# EAGLE design xns-ip67-ESP12-Temp (EAGLE 8.1.0)
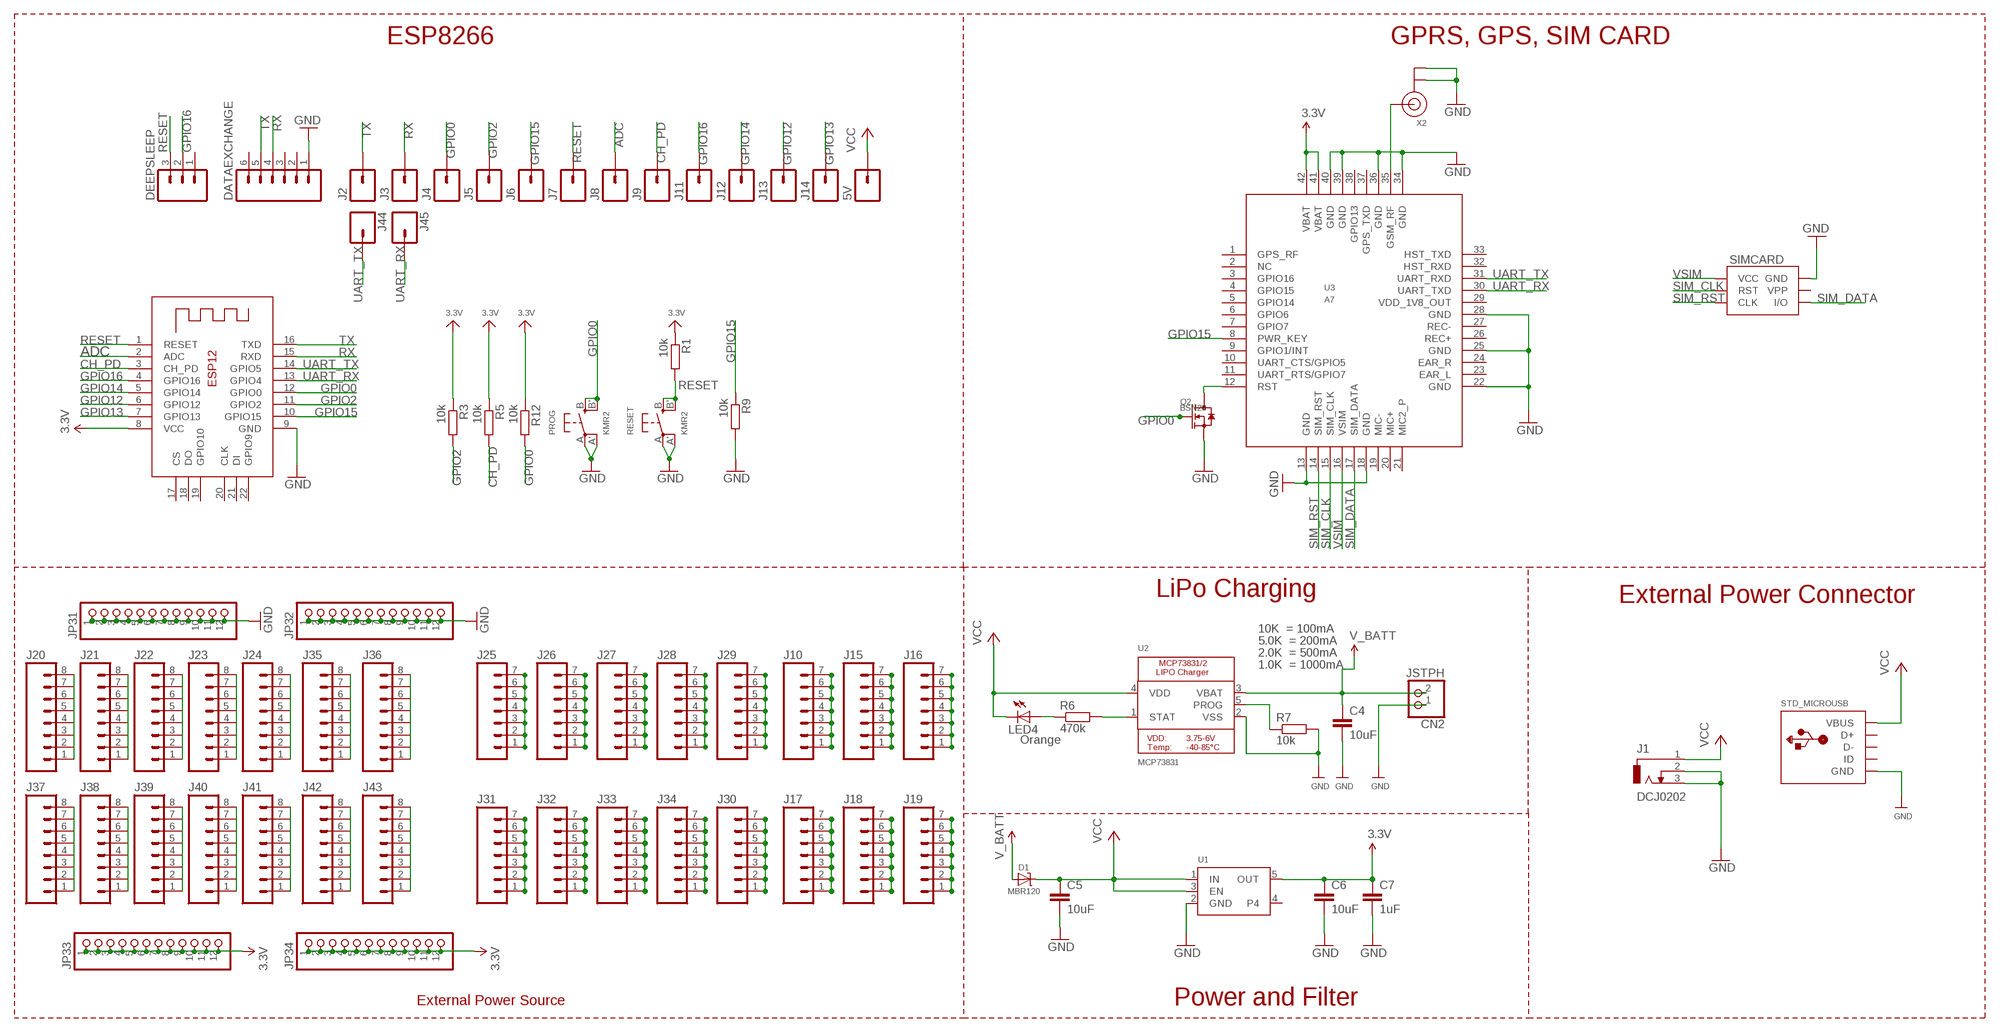
[diagram p0: schematic, sheet 1]

## Parts
5V  M01NOSILK-KIT  [1X01NS-KIT]
C4  10uF  C2.5/2  [C2.5-2]
C5  10uF  C2.5/2  [C2.5-2]
C6  10uF  C2.5/2  [C2.5-2]
C7  1uF  C2.5/2  [C2.5-2]
CN2  JSTPH  JST_2PIN  [JSTPH2]
D1  MBR120  DIODE-SCHOTTKYSOD-123  [SOD-123]
DATAEXCHANGE  M06FEMALE_LOCK  [1X06_FEMALE_LOCK.010]
DEEPSLEEP  M031X03_NO_SILK  [1X03_NO_SILK]
J1  DCJ0202  [DCJ0202]
J2  M01NOSILK-KIT  [1X01NS-KIT]
J3  M01NOSILK-KIT  [1X01NS-KIT]
J4  M01NOSILK-KIT  [1X01NS-KIT]
J5  M01NOSILK-KIT  [1X01NS-KIT]
J6  M01NOSILK-KIT  [1X01NS-KIT]
J7  M01NOSILK-KIT  [1X01NS-KIT]
J8  M01NOSILK-KIT  [1X01NS-KIT]
J9  M01NOSILK-KIT  [1X01NS-KIT]
J10  M07NO_SILK  [1X07_NO_SILK]
J11  M01NOSILK-KIT  [1X01NS-KIT]
J12  M01NOSILK-KIT  [1X01NS-KIT]
J13  M01NOSILK-KIT  [1X01NS-KIT]
J14  M01NOSILK-KIT  [1X01NS-KIT]
J15  M07NO_SILK  [1X07_NO_SILK]
J16  M07NO_SILK  [1X07_NO_SILK]
J17  M07NO_SILK  [1X07_NO_SILK]
J18  M07NO_SILK  [1X07_NO_SILK]
J19  M07NO_SILK  [1X07_NO_SILK]
J20  M08NO_SILK_FEMALE_PTH  [1X08_NO_SILK]
J21  M08NO_SILK_FEMALE_PTH  [1X08_NO_SILK]
J22  M08NO_SILK_FEMALE_PTH  [1X08_NO_SILK]
J23  M08NO_SILK_FEMALE_PTH  [1X08_NO_SILK]
J24  M08NO_SILK_FEMALE_PTH  [1X08_NO_SILK]
J25  M07NO_SILK  [1X07_NO_SILK]
J26  M07NO_SILK  [1X07_NO_SILK]
J27  M07NO_SILK  [1X07_NO_SILK]
J28  M07NO_SILK  [1X07_NO_SILK]
J29  M07NO_SILK  [1X07_NO_SILK]
J30  M07NO_SILK  [1X07_NO_SILK]
J31  M07NO_SILK  [1X07_NO_SILK]
J32  M07NO_SILK  [1X07_NO_SILK]
J33  M07NO_SILK  [1X07_NO_SILK]
J34  M07NO_SILK  [1X07_NO_SILK]
J35  M08NO_SILK_FEMALE_PTH  [1X08_NO_SILK]
J36  M08NO_SILK_FEMALE_PTH  [1X08_NO_SILK]
J37  M08NO_SILK_FEMALE_PTH  [1X08_NO_SILK]
J38  M08NO_SILK_FEMALE_PTH  [1X08_NO_SILK]
J39  M08NO_SILK_FEMALE_PTH  [1X08_NO_SILK]
J40  M08NO_SILK_FEMALE_PTH  [1X08_NO_SILK]
J41  M08NO_SILK_FEMALE_PTH  [1X08_NO_SILK]
J42  M08NO_SILK_FEMALE_PTH  [1X08_NO_SILK]
J43  M08NO_SILK_FEMALE_PTH  [1X08_NO_SILK]
J44  M01NOSILK-KIT  [1X01NS-KIT]
J45  M01NOSILK-KIT  [1X01NS-KIT]
JP31  HEADER-1X12  [1X12_ROUND]
JP32  HEADER-1X12  [1X12_ROUND]
JP33  HEADER-1X12  [1X12_ROUND]
JP34  HEADER-1X12  [1X12_ROUND]
LED4  Orange  LED5MM  [LED5MM]
PROG  KMR2  SWITCH_TACT_SMT4.6X2.8  [BTN_KMR2_4.6X2.8]
Q2  BSN20  MOSFET-N'SOT23'  [SOT23@1]
R1  10k  R0204/7  [0204/7]
R3  10k  R0204/7  [0204/7]
R5  10k  R0204/7  [0204/7]
R6  470k  R0204/7  [0204/7]
R7  10k  R0204/7  [0204/7]
R9  10k  R0204/7  [0204/7]
R12  10k  R0204/7  [0204/7]
RESET  KMR2  SWITCH_TACT_SMT4.6X2.8  [BTN_KMR2_4.6X2.8]
SIMCARD  SIMHOLDERSIM  [SIMHOLDER]
STD_MICROUSB  USB_MICRO_20329_V2  [4UCONN_20329_V2]
U1  VREG_SOT23-5  [SOT23-5]
U2  MCP73831  MCP73831/2  [SOT23-5@1]
U3  A7  [A7]
X1  ESP-12E  [ESP-12E]
X2  ANTENNA_U.FL  [U.FL]

## Nets
3.3V: C6.1 C7.1 JP33.1 JP33.2 JP33.3 JP33.4 JP33.5 JP33.6 JP33.7 JP33.8 JP33.9 JP33.10 JP33.11 JP33.12 JP34.1 JP34.2 JP34.3 JP34.4 JP34.5 JP34.6 JP34.7 JP34.8 JP34.9 JP34.10 JP34.11 JP34.12 R1.1 R3.1 R5.1 R12.1 U1.5(OUT) U3.41(VBAT) U3.42(VBAT) X1.8(VCC)
ADC: J8.1 X1.2(ADC)
CH_PD: J9.1 R5.2 X1.3(CH_PD)
GND: C4.2 C5.2 C6.2 C7.2 CN2.1 DATAEXCHANGE.1 J1.2 J1.3 JP31.1 JP31.2 JP31.3 JP31.4 JP31.5 JP31.6 JP31.7 JP31.8 JP31.9 JP31.10 JP31.11 JP31.12 JP32.1 JP32.2 JP32.3 JP32.4 JP32.5 JP32.6 JP32.7 JP32.8 JP32.9 JP32.10 JP32.11 JP32.12 PROG.A'(P1) PROG.A(P) Q2.2(S) R7.2 R9.2 RESET.A'(P1) RESET.A(P) SIMCARD.C5(GND) STD_MICROUSB.BASE@1(GND) STD_MICROUSB.BASE@2(GND) STD_MICROUSB.GND STD_MICROUSB.SPRT@1(GND) STD_MICROUSB.SPRT@2(GND) STD_MICROUSB.SPRT@3(GND) STD_MICROUSB.SPRT@4(GND) U1.2(GND) U2.2(VSS) U3.13(GND) U3.18(GND) U3.22(GND) U3.25(GND) U3.28(GND) U3.34(GND) U3.36(GND) U3.39(GND) U3.40(GND) X1.9(GND) X2.1(GND) X2.2(GND)
GPIO0: J4.1 PROG.B'(S1) PROG.B(S) Q2.1(G) R12.2 X1.12(GPIO0)
GPIO2: J5.1 R3.2 X1.11(GPIO2)
GPIO12: J13.1 X1.6(GPIO12)
GPIO13: J14.1 X1.7(GPIO13)
GPIO14: J12.1 X1.5(GPIO14)
GPIO15: J6.1 R9.1 U3.8(PWR_KEY) X1.10(GPIO15)
GPIO16: DEEPSLEEP.2 J11.1 X1.4(GPIO16)
N$1: J20.1 J20.2 J20.3 J20.4 J20.5 J20.6 J20.7 J20.8
N$2: J21.1 J21.2 J21.3 J21.4 J21.5 J21.6 J21.7 J21.8
N$3: U3.35(GSM_RF) X2.3(SIGNAL)
N$4: J22.1 J22.2 J22.3 J22.4 J22.5 J22.6 J22.7 J22.8
N$5: J23.1 J23.2 J23.3 J23.4 J23.5 J23.6 J23.7 J23.8
N$6: J24.1 J24.2 J24.3 J24.4 J24.5 J24.6 J24.7 J24.8
N$7: J35.1 J35.2 J35.3 J35.4 J35.5 J35.6 J35.7 J35.8
N$8: J37.1 J37.2 J37.3 J37.4 J37.5 J37.6 J37.7 J37.8
N$9: J38.1 J38.2 J38.3 J38.4 J38.5 J38.6 J38.7 J38.8
N$10: J39.1 J39.2 J39.3 J39.4 J39.5 J39.6 J39.7 J39.8
N$11: J40.1 J40.2 J40.3 J40.4 J40.5 J40.6 J40.7 J40.8
N$12: J10.1 J10.2 J10.3 J10.4 J10.5 J10.6 J10.7
N$13: J41.1 J41.2 J41.3 J41.4 J41.5 J41.6 J41.7 J41.8
N$14: J15.1 J15.2 J15.3 J15.4 J15.5 J15.6 J15.7
N$15: J16.1 J16.2 J16.3 J16.4 J16.5 J16.6 J16.7
N$16: J17.1 J17.2 J17.3 J17.4 J17.5 J17.6 J17.7
N$17: J18.1 J18.2 J18.3 J18.4 J18.5 J18.6 J18.7
N$18: J19.1 J19.2 J19.3 J19.4 J19.5 J19.6 J19.7
N$19: J42.1 J42.2 J42.3 J42.4 J42.5 J42.6 J42.7 J42.8
N$20: J36.1 J36.2 J36.3 J36.4 J36.5 J36.6 J36.7 J36.8
N$21: J43.1 J43.2 J43.3 J43.4 J43.5 J43.6 J43.7 J43.8
N$24: R7.1 U2.5(PROG)
N$52: J31.1 J31.2 J31.3 J31.4 J31.5 J31.6 J31.7
N$54: J32.1 J32.2 J32.3 J32.4 J32.5 J32.6 J32.7
N$55: R6.2 U2.1(STAT)
N$56: J33.1 J33.2 J33.3 J33.4 J33.5 J33.6 J33.7
N$58: J34.1 J34.2 J34.3 J34.4 J34.5 J34.6 J34.7
N$59: LED4.A R6.1
N$71: J25.1 J25.2 J25.3 J25.4 J25.5 J25.6 J25.7
N$72: J26.1 J26.2 J26.3 J26.4 J26.5 J26.6 J26.7
N$73: J27.1 J27.2 J27.3 J27.4 J27.5 J27.6 J27.7
N$74: J28.1 J28.2 J28.3 J28.4 J28.5 J28.6 J28.7
N$75: J29.1 J29.2 J29.3 J29.4 J29.5 J29.6 J29.7
N$76: J30.1 J30.2 J30.3 J30.4 J30.5 J30.6 J30.7
RESET: DEEPSLEEP.3 J7.1 R1.2 RESET.B'(S1) RESET.B(S) X1.1(RESET)
RESET_KEY: Q2.3(D) U3.12(RST)
RX: DATAEXCHANGE.4 J3.1 X1.15(RXD)
SIM_CLK: SIMCARD.C2(RST) U3.15(SIM_CLK)
SIM_DATA: SIMCARD.C7(I/O) U3.17(SIM_DATA)
SIM_RST: SIMCARD.C3(CLK) U3.14(SIM_RST)
TX: DATAEXCHANGE.5 J2.1 X1.16(TXD)
UART_RX: J45.1 U3.30(UART_TXD) X1.13(GPIO4)
UART_TX: J44.1 U3.31(UART_RXD) X1.14(GPIO5)
V_BATT: C4.1 CN2.2 D1.A U2.3(VBAT)
VCC: 5V.1 C5.1 D1.C J1.1 LED4.K(C) STD_MICROUSB.VBUS U1.1(IN) U1.3(EN) U2.4(VDD)
VSIM: SIMCARD.C1(VCC) U3.16(VSIM)
Unconnected: DATAEXCHANGE.2 DATAEXCHANGE.3 DATAEXCHANGE.6 DEEPSLEEP.1 SIMCARD.C6(VPP) STD_MICROUSB.D+ STD_MICROUSB.D- STD_MICROUSB.ID U1.4 U3.1(GPS_RF) U3.2(NC) U3.3(GPIO16) U3.4(GPIO15) U3.5(GPIO14) U3.6(GPIO6) U3.7(GPIO7) U3.9(GPIO1/INT) U3.10(UART_CTS/GPIO5) U3.11(UART_RTS/GPIO7) U3.19(MIC-) U3.20(MIC+) U3.21(MIC2_P) U3.23(EAR_L) U3.24(EAR_R) U3.26(REC+) U3.27(REC-) U3.29(VDD_1V8_OUT) U3.32(HST_RXD) U3.33(HST_TXD) U3.37(GPS_TXD) U3.38(GPIO13) X1.17(CS) X1.18(DO) X1.19(GPIO10) X1.20(CLK) X1.21(DI) X1.22(GPIO9)

## Notes on the sheet
- ESP8266 | GPRS, GPS, SIM CARD
- LiPo Charging | External Power Connector
- 10K  = 100mA
- 5.0K  = 200mA
- 2.0K  = 500mA
- 1.0K  = 1000mA
- External Power Source | Power and Filter

## Library data of the parts
5V J2-J9 J11-J14 J44 J45 = SparkFun-Connectors:M01: Header 1 Standard 1-pin 0.1" header. Use with straight break away headers (SKU : PRT-00116), right angle break away headers (PRT-00553), swiss pins (PRT-00743), machine pins (PRT-00117), and female headers (PRT-00115). SMTSO-256-ET is a "flush mount" nut for a 4-40 screw. The older package used to be too tight, and did not allow it to sit properly thru the drill hit. The latest (0.165DIA) fits nice and snug.
C4-C7 = capacitor-wima:C: CAPACITOR naming: grid - package width
CN2 = microbuilder:JST_2PIN: JST 2-Pin Right-Angle Connector PH-Series - 4UConnector: 17311 SH-Series - 4UConnector: 07278
D1 = microbuilder:DIODE-SCHOTTKY
DATAEXCHANGE = SparkFun-Connectors:M06: Header 6 Standard 6-pin 0.1" header. Use with straight break away headers (SKU : PRT-00116), right angle break away headers (PRT-00553), swiss pins (PRT-00743), machine pins (PRT-00117), and female headers (PRT-00115). Molex polarized connector foot print use with SKU : PRT-08094 with associated crimp pins and housings. NOTES ON THE VARIANTS LOCK and LOCK_LONGPADS... This footprint was designed to help hold the alignment of a through-hole component (i.e. 6-pin header) while soldering it into place. You may notice that each hole has been shifted either up or down by 0.005 of an inch from it's more standard position (which is a perfectly straight line). This slight alteration caused the pins (the squares in the middle) to touch the edges of the holes. Because they are alternating, it causes a "brace" to hold the component in place. 0.005 has proven to be the perfect amount of "off-center" position when using our standard breakaway headers. Although looks a little odd when you look at the bare footprint, once you have a header in there, the alteration is very hard to notice. Also,if you push a header all the way into place, it is covered up entirely on the bottom side. This idea of altering the position of holes to aid alignment will be further integrated into the Sparkfun Library for other footprints. It can help hold any component with 3 or more connection pins.
DEEPSLEEP = SparkFun-Connectors:M03: Header 3 Standard 3-pin 0.1" header. Use with straight break away headers (SKU : PRT-00116), right angle break away headers (PRT-00553), swiss pins (PRT-00743), machine pins (PRT-00117), and female headers (PRT-00115). Molex polarized connector foot print use with SKU : PRT-08232 with associated crimp pins and housings.
J1 = con-jack:DCJ0202: DC POWER JACK Source: DCJ0202.pdf; OC_FARNELL: unknown; OC_NEWARK: unknown
J10 J15-J19 J25-J34 = SparkFun-Connectors:M07: Header 7 Standard 7-pin 0.1" header. Use with straight break away headers (SKU : PRT-00116), right angle break away headers (PRT-00553), swiss pins (PRT-00743), machine pins (PRT-00117), and female headers (PRT-00115). NOTES ON THE VARIANTS LOCK and LOCK_LONGPADS... This footprint was designed to help hold the alignment of a through-hole component (i.e. 7-pin header) while soldering it into place. You may notice that each hole has been shifted either up or down by 0.005 of an inch from it's more standard position (which is usually a perfectly straight line). This slight alteration caused the pins (the squares in the middle) to touch the edges of the holes. Because they are alternating, it causes a "brace" to hold the header in place. 0.005 has proven to be the perfect amount of "off-center" position when using our standard breakaway headers. Although looks a little odd when you look at the bare footprint, once you have a header in there, the alteration is very hard to notice. Also, if you push a header all the way into place, it is covered up entirely on the bottom side. This idea of altering the position of holes to aid alignment will be further integrated into the Sparkfun Library for other footprints. It can help hold any component with 3 or more connection pins.
J20-J24 J35-J43 = SparkFun-Connectors:M08: Header 8 Standard 8-pin 0.1" header. Use with straight break away headers (SKU : PRT-00116), right angle break away headers (PRT-00553), swiss pins (PRT-00743), machine pins (PRT-00117), and female headers (PRT-00115).; PROD_ID: CONN-08438
JP31-JP34 = microbuilder:HEADER-1X12
LED4 = adafruit:LED: LED OSRAM: - CHIPLED LG R971, LG N971, LY N971, LG Q971, LY Q971, LO R971, LY R971 LH N974, LH R974 LS Q976, LO Q976, LY Q976 LO Q996 - Hyper CHIPLED LW Q18S LB Q993, LB Q99A, LB R99A - SideLED LS A670, LO A670, LY A670, LG A670, LP A670 LB A673, LV A673, LT A673, LW A673 LH A674 LY A675 LS A676, LA A676, LO A676, LY A676, LW A676 LS A679, LY A679, LG A679 - Hyper Micro SIDELED® LS Y876, LA Y876, LO Y876, LY Y876 LT Y87S - SmartLED LW L88C, LW L88S LB L89C, LB L89S, LG L890 LS L89K, LO L89K, LY L89K LS L896, LA L896, LO L896, LY L896 - TOPLED LS T670, LO T670, LY T670, LG T670, LP T670 LSG T670, LSP T670, LSY T670, LOP T670, LYG T670 LG T671, LOG T671, LSG T671 LB T673, LV T673, LT T673, LW T673 LH T674 LS T676, LA T676, LO T676, LY T676, LB T676, LH T676, LSB T676, LW T676 LB T67C, LV T67C, LT T67C, LS T67K, LO T67K, LY T67K, LW E67C LS E67B, LA E67B, LO E67B, LY E67B, LB E67C, LV E67C, LT E67C LW T67C LS T679, LY T679, LG T679 LS T770, LO T770, LY T770, LG T770, LP T770 LB T773, LV T773, LT T773, LW T773 LH T774 LS E675, LA E675, LY E675, LS T675 LS T776, LA T776, LO T776, LY T776, LB T776 LHGB T686 LT T68C, LB T68C - Hyper Mini TOPLED® LB M676 - Mini TOPLED Santana® LG M470 LS M47K, LO M47K, LY M47K Source: http://www.osram.convergy.de/
PROG RESET = microbuilder:SWITCH_TACT_SMT: SMT Tact Switches 6x6mm - Digikey: P12940SCT-ND KMR2 (4.6x2.8mm) - Digikey: 401-1426-1-ND EVQ-PQHB55 - Light Touch, 160GF (4.5x4.5mm) - Digikey: P8090SCT-ND KMT0 - KMT021 NGJ LHS (etc.) IP68/Waterproof - Digikey: CKN10289CT-ND
Q2 = Discrete:MOSFET-N: IRLL014: http://www.vishay.com/docs/91319/sihll014.pdf
R1 R3 R5-R7 R9 R12 = eagle-ltspice:R: RESISTOR, European symbol; SPICEMODEL: NONE; SPICEPREFIX: R
SIMCARD = SparkFun-Connectors:SIMHOLDER: SIM Socket Socket for SIM cellular cards. Schematic element and footprint production proven. Spark Fun Electronics SKU : PRT-00548; PROD_ID: CONN-08536
STD_MICROUSB = microbuilder:USB: USB Connectors USBMINIB - Surface Mount Female Mini-B USB Connector 4UConnector: 06564
U1 = microbuilder:VREG_SOT23-5: SOT23-5 Fixed Voltage Regulators Part Current Out V Out V In V Dropout θJA (°C/W) TJ (°C) Digikey Part No. ADP121 150mA 3.3V 3.4-5.5V 0.09V @ 150mA -- -- ADP121-AUJZ33R7CT-ND ADP121 150mA 3.0V 3.1-5.5V 0.09V @ 150mA -- -- ADP121-AUJZ30R7CT-ND ADP122 300mA 3.3V 3.4-5.5V 0.085V @ 300mA -- -- ADP122AUJZ-3.3-R7CT-ND ADP1712 300mA 3.3V 3.5-5.5V 0.17V @ 300mA -- -- ADP1712AUJZ-3.3-R7TR-ND AP7311 (Low Cost) 150mA 3.3V 3.5-6V 0.15V @ 150mA -- -- AP7311-33WG-7DICT-ND LD39015M18R 150mA 1.8V 1.9V-5.5V 0.08V @ 100mA -- -- 497-6977-1-ND LP2985A-33DBVR 150mA 3.3V 3.3-16V 0.28V @ 150mA 206 150 296-18479-1-ND MCP1824T-3302E/OT 300mA 3.3V 3.5V-6V 0.2V @ 300mA -- -- MCP1824T-3302E/OTCT-ND MIC5205-2.5YM5 TR 150mA 2.5V 2.7-16V 0.165V @ 150mA -- -- 576-1257-2-ND MIC5205-3.0YM5 TR 150mA 3.0V 3.2V-16V 0.165V @ 150mA -- -- 576-1258-2-ND MIC5205-3.3YM5 TR 150mA 3.3V 3.5V-16V 0.165V @ 150mA -- -- 576-1259-2-ND TPS780330220 150mA 3.3V+2.2V 3.6-5.5V 250mV Max -- -- 296-23332-1-ND TDA3663/N1,135 100mA 3.3V 3.5-45V 0.18V @ 50mA -- -- 568-5343-1-ND Max operating temp can be calculated using θJA, TJ (max junction temperature), and power in watts. Set the "Maximum Ambient Temperature" until it reaches TJ ("Max Junction Temperature"), which is the absolute limit for safe use of the regulator: Heat Sink Temperature Calculator <http://www.daycounter.com/Calculators/Heat-Sink-Temperature-Calculator.phtml> For example, With 12V source into a 3.3V LP2985 and a 30mA load, we are dissipating (12V-3.3V) * 0.03A = 0.261W. With a θJA of 206 °C/W, a TJ of 150°C, and 261mW we can safely use the chip without a heat sink up to 75°C (=147.1°C Junction Temperature).
U2 = microbuilder:MCP73831/2: MCP73831/2 LIPO Charger VDD: 3.75 - 6V Temp -40 - 85°C Programmable Charge Rate: 15-500mA NOTE: STAT is a tri-state logic output on the MCP73831 and an open-drain output on the MCP73832. SOT23-5 with 4.2V output and tri-state logic on STAT = MCP73831T-2ACI/OT
U3 = IC:A7
X1 = microbuilder:ESP-12E
X2 = adafruit:ANTENNA_U.FL: U.FL Antenna Connector

## Board
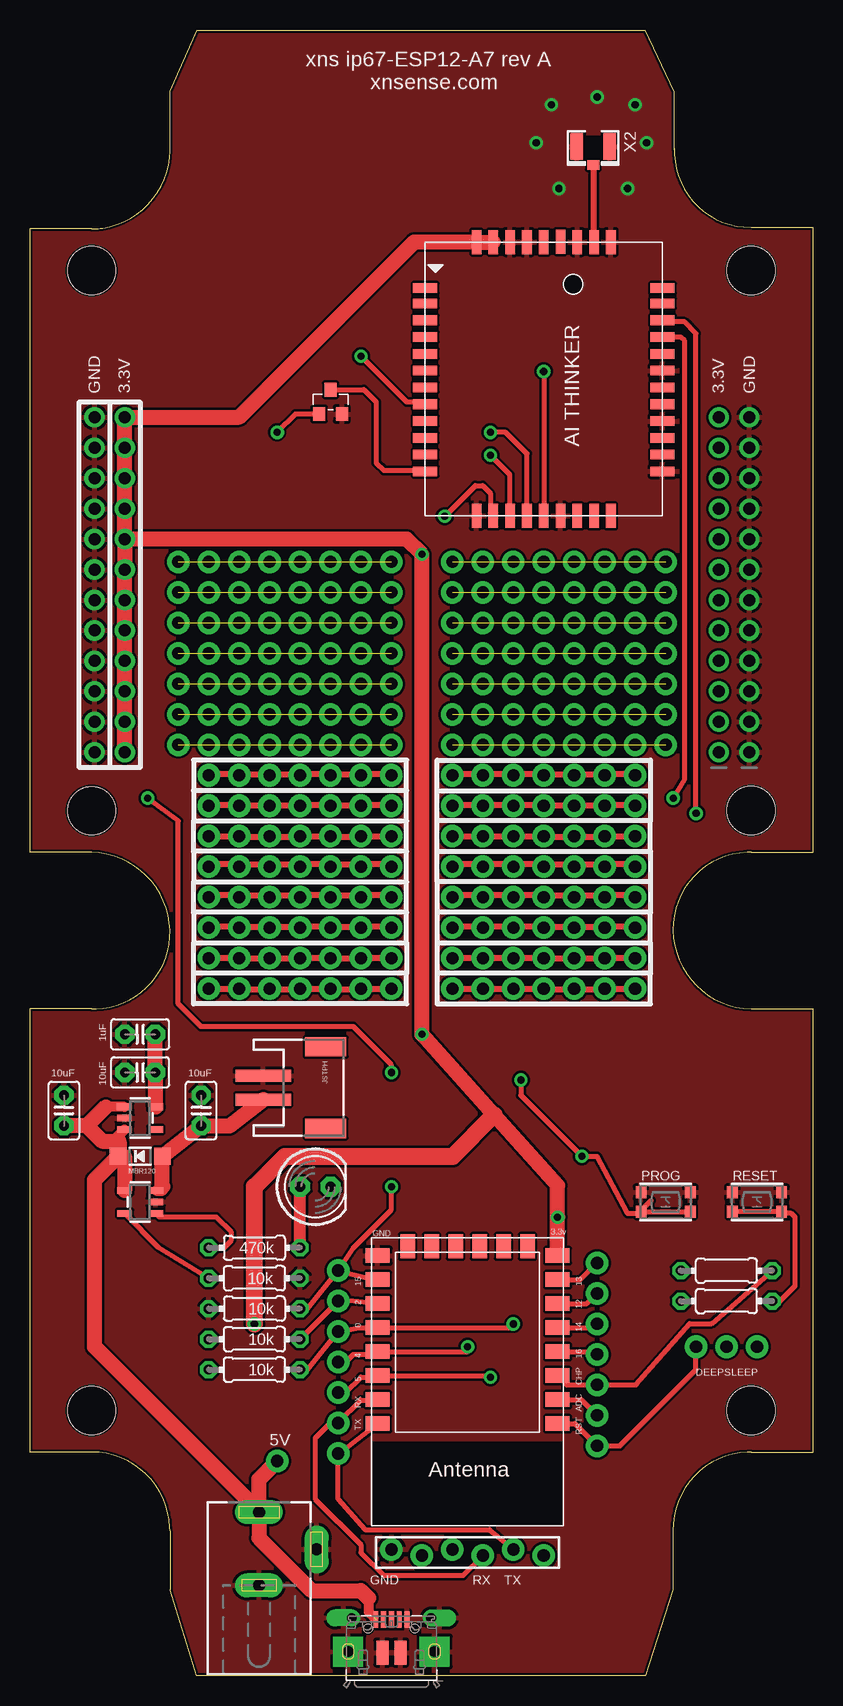
[diagram p1: board, top side]
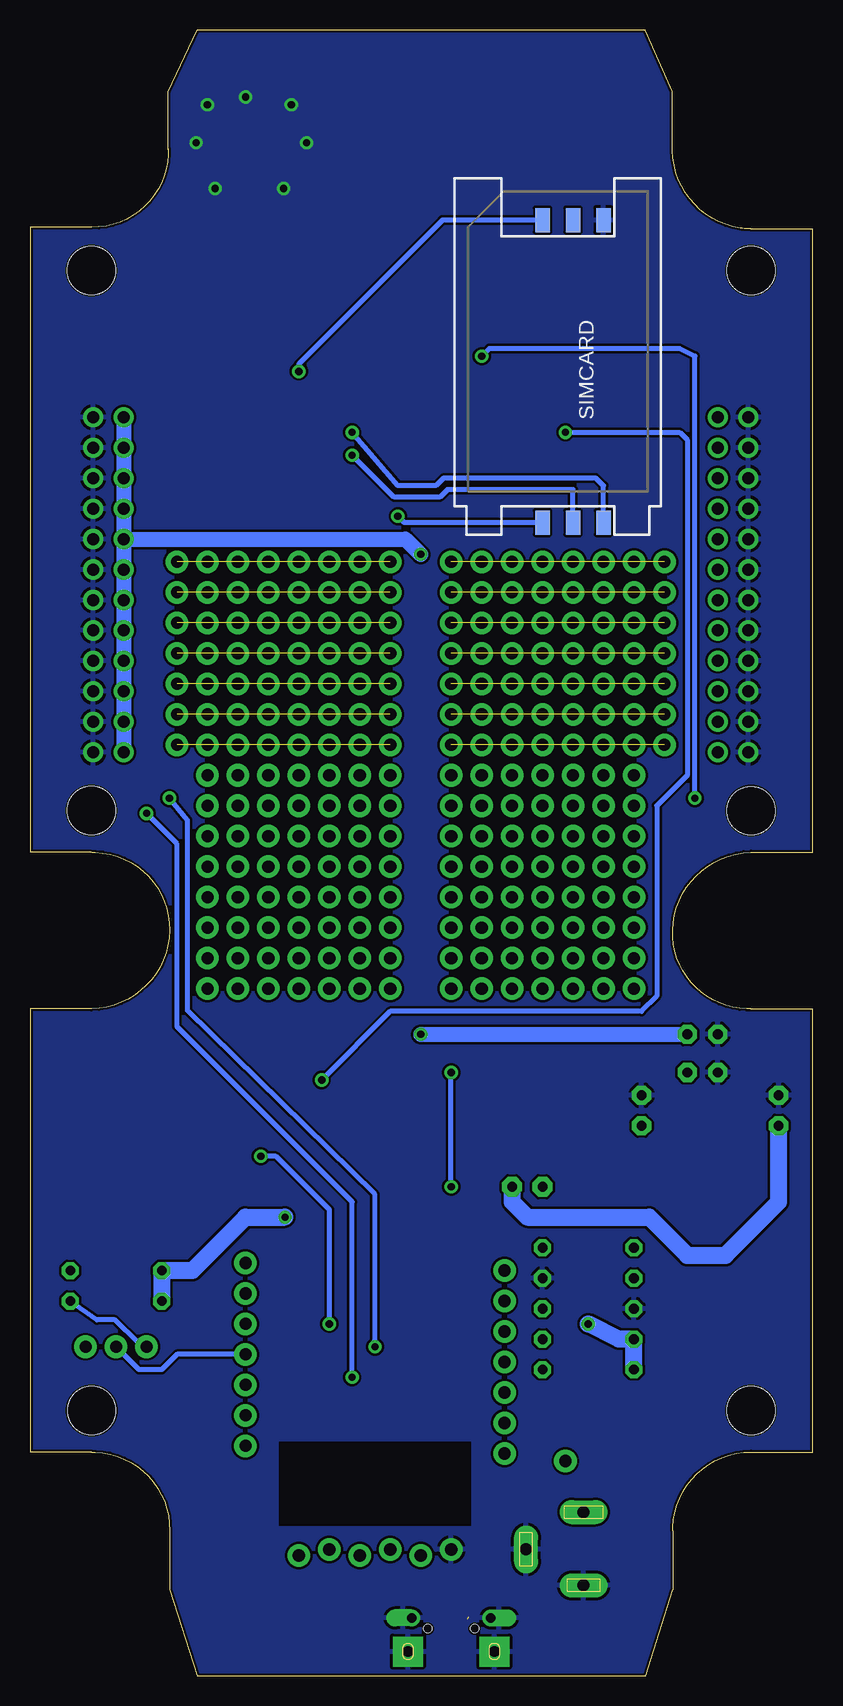
[diagram p2: board, bottom side, seen from below]

Size 65.26 x 137.16 mm. Coordinates in mm from the lower left corner, seen from the top.
Outline: 53.72,127.17 53.72,132.03 51.33,137.16 13.93,137.16 11.68,132.06 11.68,127.11 arc-80 6.05,120.65 arc-7 5.5,120.6 5.14,120.59 0.01,120.59 0.01,68.64 5.14,68.64 arc-87 11.67,62.12 arc-90 5.5,55.59 5.14,55.58 0,55.58 0,18.65 5.13,18.65 arc-88 11.66,12.37 11.67,12.11 11.67,7.17
Outline: 53.73,127.28 arc2 53.74,126.78 arc88 60.13,120.72 65.26,120.72 65.26,68.63 60.14,68.63
Outline: 60.13,68.63 59.81,68.62 arc89 53.62,62.12 arc88 60.13,55.59 65.26,55.59 65.26,18.64 60.13,18.64 59.82,18.63 arc89 53.62,12.09 53.62,7.17 51.33,0 13.9,0 11.67,7.17
Outline: 11.67,7.17 11.67,7.16
Copper layers (1*16): Top 0.035mm / dielectric 1.5mm / Bottom 0.035mm
Design rules "SparkFun *": minimum track width 8mil, minimum drill 20mil, track to track 8mil, track to pad 6mil, pad to pad 8mil, via to via 8mil, smd to smd 8mil, copper to edge 6mil, drill to drill 8mil, minimum pad ring 12mil, minimum via ring 10mil, stop-mask expansion 4mil, vias tented up to drill 20mil, thermal gap 10mil
Holes 4 mm at 5.14,117.11 60.13,117.12 5.14,72.1 60.13,72.11 5.14,22.12 60.12,22.12

### Footprints (pad centres in the part's own frame; a part is rotated, then mirrored left to right if it is on the bottom)
1X01NS-KIT = drill 1.016 pad 1.88: 1 0,0
C2.5-2 = drill 0.813 pad 1.6 octagon: 1 -1.27,0; 2 1.27,0
JSTPH2 = smd 1 x 4.6: 1 -1,-3.7; 2 1,-3.7 | smd 1.6 x 3.4: NC1 -3.4,1.5; NC2 3.4,1.5
SOD-123 = smd 1.4 x 1.4: A 1.85,0; C -1.85,0
1X06_FEMALE_LOCK.010 = drill 1.016 pad 1.88: 1 0,0.254; 2 2.54,-0.254; 3 5.08,0.254; 4 7.62,-0.254; 5 10.16,0.254; 6 12.7,-0.254
1X03_NO_SILK = drill 1.016 pad 1.88: 1 0,0; 2 2.54,0; 3 5.08,0
DCJ0202 = drill 1 pad 2 long: 1 0,3.1; 2 4.8,0; 3 0,-3
1X07_NO_SILK = drill 1.016 pad 1.88: 1 0,0; 2 2.54,0; 3 5.08,0; 4 7.62,0; 5 10.16,0; 6 12.7,0; 7 15.24,0
1X08_NO_SILK = drill 1.016 pad 1.88: 1 0,0; 2 2.54,0; 3 5.08,0; 4 7.62,0; 5 10.16,0; 6 12.7,0; 7 15.24,0; 8 17.78,0
1X12_ROUND = drill 1 pad 1.676: 1 -13.97,0; 2 -11.43,0; 3 -8.89,0; 4 -6.35,0; 5 -3.81,0; 6 -1.27,0; 7 1.27,0; 8 3.81,0; 9 6.35,0; 10 8.89,0; 11 11.43,0; 12 13.97,0
LED5MM = drill 0.813 pad 1.676 octagon: A -1.27,0; K 1.27,0
BTN_KMR2_4.6X2.8 = smd 0.9 x 1: A 2.05,0.8; A' -2.05,0.8; B 2.05,-0.8; B' -2.05,-0.8
SOT23@1 = smd 1.016 x 1.143: 1 -0.95,-1.016; 2 0.95,-1.016; 3 0,1.016
0204/7 = drill 0.813 octagon: 1 -3.81,0; 2 3.81,0
SIMHOLDER = smd 2 x 1.2: C1 -12.61,-3.81; C2 -12.61,-1.27; C3 -12.61,1.27; C5 12.61,-3.81; C6 12.61,-1.27; C7 12.61,1.27
4UCONN_20329_V2 = smd 1 x 2: BASE@1 -0.75,-2; BASE@2 0.75,-2 | smd 0.4 x 1.35: D+ 0,0.775; D- -0.65,0.775; GND 1.3,0.775; ID 0.65,0.775; VBUS -1.3,0.775 | drill 0.8 pad 1.2 offset: SPRT@1 -3.3,0.9; SPRT@2 3.3,0.9 | drill 0.9 pad 2.5 square: SPRT@3 -3.6,-1.9; SPRT@4 3.6,-1.9 | hole 0.7: -1.95,0; 1.95,0
SOT23-5 = smd 0.55 x 1.2: 1 -0.95,-1.3; 2 0,-1.3; 3 0.95,-1.3; 4 0.95,1.3; 5 -0.95,1.3
SOT23-5@1 = smd 0.55 x 1.2: 1 -0.95,-1.3; 2 0,-1.3; 3 0.95,-1.3; 4 0.95,1.3; 5 -0.95,1.3
A7 = smd 0.8 x 2: 1 7.57,9.9; 2 6.3,9.9; 3 4.9,9.9; 4 3.5,9.9; 5 2.1,9.9; 6 0.7,9.9; 7 -0.7,9.9; 8 -2.1,9.9; 9 -3.5,9.9; 10 -4.9,9.9; 11 -6.3,9.9; 12 -7.7,9.9; 22 -7.7,-9.9; 23 -6.3,-9.9; 24 -4.9,-9.9; 25 -3.5,-9.9; 26 -2.1,-9.9; 27 -0.7,-9.9; 28 0.7,-9.9; 29 2.1,-9.9; 30 3.5,-9.9; 31 4.9,-9.9; 32 6.3,-9.9; 33 7.57,-9.9 | smd 2 x 0.8: 13 -11.4,5.6; 14 -11.4,4.2; 15 -11.4,2.8; 16 -11.4,1.4; 17 -11.4,0; 18 -11.4,-1.4; 19 -11.4,-2.8; 20 -11.4,-4.2; 21 -11.4,-5.6; 34 11.4,-5.6; 35 11.4,-4.2; 36 11.4,-2.8; 37 11.46,-1.4; 38 11.4,0; 39 11.4,1.4; 40 11.4,2.8; 41 11.4,4.2; 42 11.4,5.6
ESP-12E = smd 2 x 1.2: 1 -7.5,5.77; 2 -7.5,3.77; 3 -7.5,1.77; 4 -7.5,-0.23; 5 -7.5,-2.23; 6 -7.5,-4.23; 7 -7.5,-6.23; 8 -7.5,-8.23; 9 7.5,-8.23; 10 7.5,-6.23; 11 7.5,-4.23; 12 7.5,-2.23; 13 7.5,-0.23; 14 7.5,1.77; 15 7.5,3.77; 16 7.5,5.77 | smd 1.2 x 2: 17 -5,-9; 18 -3,-9; 19 -1,-9; 20 1,-9; 21 3,-9; 22 5,-9
U.FL = smd 2.2 x 1.05: 1 0,1.375; 2 0,-1.375 | smd 0.8 x 1: 3 1.525,0

### Placement (x,y rotation side)
5V  20.62,17.9 0 top
C4  14.26,47.11 90 top
C5  2.83,47.11 90 top
C6  9.19,50.29 180 top
C7  9.19,53.46 180 top
CN2  23.16,49.02 270 top
D1  9.19,43.3 0 top
DATAEXCHANGE  30.14,10.28 0 top
DEEPSLEEP  60.62,27.43 180 top
J1  19.1,10.55 0 top
J2  25.7,18.54 0 top
J3  25.7,21.08 0 top
J4  25.7,28.7 0 top
J5  25.7,31.23 0 top
J6  25.7,33.77 0 top
J7  47.29,19.17 0 top
J8  47.29,21.71 0 top
J9  47.29,24.25 0 top
J10  14.9,62.35 0 top
J11  47.29,26.79 0 top
J12  47.29,29.33 0 top
J13  47.29,31.87 0 top
J14  47.29,34.41 0 top
J15  14.9,59.81 0 top
J16  14.9,57.27 0 top
J17  35.22,62.35 0 top
J18  35.22,59.81 0 top
J19  35.22,57.27 0 top
J20  12.36,85.21 0 top
J21  12.36,92.83 0 top
J22  12.36,90.29 0 top
J23  12.36,87.75 0 top
J24  12.36,82.67 0 top
J25  50.46,64.89 180 top
J26  50.46,67.43 180 top
J27  50.46,69.97 180 top
J28  50.46,72.51 180 top
J29  50.46,75.05 180 top
J30  30.14,64.89 180 top
J31  30.14,67.43 180 top
J32  30.14,69.97 180 top
J33  30.14,72.51 180 top
J34  30.14,75.05 180 top
J35  12.36,80.13 0 top
J36  35.22,92.83 0 top
J37  35.22,90.29 0 top
J38  35.22,87.75 0 top
J39  35.22,85.21 0 top
J40  35.22,82.67 0 top
J41  35.22,80.13 0 top
J42  35.22,77.59 0 top
J43  12.36,77.59 0 top
J44  25.7,23.62 0 top
J45  25.7,26.16 0 top
JP31  5.38,90.92 90 top
JP32  59.99,90.92 90 top
JP33  57.45,90.92 90 top
JP34  7.91,90.92 90 top
LED4  23.79,40.76 0 top
PROG  53,39.49 0 top
Q2  25.06,106.16 0 top
R1  58.08,31.23 0 top
R3  18.71,28.06 0 top
R5  58.08,33.77 0 top
R6  18.71,35.68 180 top
R7  18.71,33.14 0 top
R9  18.71,30.6 180 top
R12  18.71,25.52 0 top
RESET  60.62,39.49 0 top
SIMCARD  21.25,108.7 90 bottom
STD_MICROUSB  30.14,3.93 0 top
U1  9.19,46.48 270 top
U2  9.19,39.49 90 top
U3  42.84,108.07 90 top
X1  36.49,26.79 180 top
X2  46.97,127.44 270 top

### Tracks (layer width: path | path; a pad name or v marks a point on that pad's centre or on a via)
3.3V  (via drill 0.6)
  Top 1.27: U1.5 10.48,50.26 C6.1 C7.1 | JP34.1 JP34.2 JP34.3 JP34.4 JP34.5 JP34.6 JP34.7 JP34.8 | JP34.8 JP34.9 JP34.10 JP34.11 JP34.12 17.44,104.89 32.05,119.5 37.21,119.5 U3.42 | U3.42 U3.41 | U3.42 37.24,119.38 | X1.8 v43.99,38.22 43.99,40.88 38.71,46.76 v32.68,53.46 v32.68,93.46 31.41,94.73 JP34.8
  Top 1.422: v18.71,29.33 18.71,40.76 21.25,43.3 35.25,43.3 38.71,46.76
  Bottom 1.27: JP33.12 JP33.11 JP33.10 JP33.9 JP33.8 | JP33.8 JP33.7 JP33.6 JP33.5 JP33.4 JP33.3 JP33.2 JP33.1 | v32.68,53.46 C7.1 | JP33.8 33.95,94.73 v32.68,93.46
  Bottom 1.422: v43.99,38.22 47.29,38.22 51.73,33.77 R5.1 R1.1 | R12.1 R3.1 16.17,28.06 v18.71,29.33
ADC
  Top 0.406: X1.2 45.98,23.02 J8.1
CH_PD
  Top 0.406: X1.3 44.76,24.25 J9.1 50.53,24.25 55,29.36 56.84,29.36 R5.2
GND  (via drill 0.6)
  Top 0.5: 7.92,46.48 U1.2 7.92,46.48
  Bottom 0.5: 17.38,121.17 SIMCARD.C5 | 5.64,105.19 JP31.12
  other vias: 43.48,130.93 47.29,131.56 42.2,127.75 44.11,123.94 49.83,123.94 51.41,127.75 50.46,130.93
  pour Top: -0.34,137.28 65.7,137.28 65.7,-1.15 0.29,-1.15
  pour Bottom: 65.7,137.28 -0.34,137.28 0.29,-1.15 65.7,-1.15
GPIO0  (via drill 0.6)
  Top 0.406: 29.3,29.33 X1.12 | R12.2 23.16,25.52 J4.1 27.4,29.01 X1.12 | PROG.B' PROG.B | PROG.B' 50.95,38.77 51.81,39.62 | X1.12 39.99,29.02 v40.3,29.33 | PROG.B' 50.8,38.54 49.83,38.54 47.29,43.3 v46.02,43.3 40.94,48.38 v40.94,49.65 | Q2.1 22.14,105.15 v20.62,103.62
  Bottom 0.406: v40.3,29.33 40.3,38.86 44.75,43.3 v46.02,43.3 | v40.94,49.65 35.22,55.37 14.26,55.37 12.99,56.63 12.99,72.51 10.46,75.05 10.46,102.99 11.09,103.62 v20.62,103.62
GPIO2
  Top 0.406: X1.11 25.8,31.34 J5.1 R3.2
GPIO12
  Top 0.406: X1.6 46.44,31.02 J13.1
GPIO13
  Top 0.406: X1.7 45.9,33.02 J14.1
GPIO14
  Top 0.406: X1.5 46.98,29.02 J12.1
GPIO15  (via drill 0.6)
  Top 0.406: R9.1 23.16,30.6 J6.1 | J6.1 28.23,33.14 X1.10 | J6.1 26.96,35.68 30.14,38.86 v30.14,40.76 | v30.14,50.29 30.14,50.92 26.96,54.09 14.26,54.09 12.36,56 12.36,71.24 v9.82,73.14 | v27.6,109.97 31.41,106.16 32.75,106.16 U3.8
  Bottom 0.406: v30.14,40.76 v30.14,50.29 | v9.82,73.14 9.82,109.97 11.09,110.61 26.96,110.61 v27.6,109.97
GPIO16
  Top 0.406: X1.4 47.05,27.02 J11.1
  Bottom 0.406: J11.1 53,26.79 54.27,25.52 56.18,25.52 DEEPSLEEP.2
N$1  (7 unrouted)
N$2  (7 unrouted)
N$3
  Top 0.406: 47.04,125.84 X2.3
  Top 0.508: U3.35 47.04,125.84
N$4  (7 unrouted)
N$5  (7 unrouted)
N$6  (7 unrouted)
N$7  (7 unrouted)
N$8  (7 unrouted)
N$9  (7 unrouted)
N$10  (7 unrouted)
N$11  (7 unrouted)
N$12
  Top 0.5: J10.7 30.1,62.42 27.82,62.42 J10.6 27.49,62.42 25.21,62.42 J10.5 24.88,62.42 22.6,62.42 J10.4 22.27,62.42 19.99,62.42 J10.3 19.66,62.42 17.7,62.42 J10.2 17.38,62.42 15.1,62.42 J10.1
N$13  (7 unrouted)
N$14
  Top 0.5: J15.7 30.1,59.82 27.82,59.82 J15.6 27.49,59.82 25.21,59.82 J15.5 24.88,59.82 22.6,59.82 J15.4 22.27,59.82 J15.3 19.66,59.82 17.7,59.82 J15.2 17.38,59.82 15.1,59.82 J15.1
N$15
  Top 0.5: J16.7 30.1,57.2 27.82,57.2 J16.6 27.49,57.2 25.21,57.2 J16.5 24.88,57.2 22.6,57.2 J16.4 22.27,57.2 19.99,57.2 J16.3 19.66,57.2 17.7,57.2 J16.2 17.38,57.2 15.1,57.2 J16.1
N$16
  Top 0.5: J17.7 50.33,62.42 48.04,62.42 J17.6 47.72,62.42 45.43,62.42 J17.5 45.11,62.42 43.15,62.42 J17.4 42.82,62.42 40.54,62.42 J17.3 40.21,62.42 37.93,62.42 J17.2 37.6,62.42 35.32,62.42 J17.1
N$17
  Top 0.5: J18.7 50.33,59.82 48.04,59.82 J18.6 47.72,59.82 45.43,59.82 J18.5 45.11,59.82 43.15,59.82 J18.4 42.82,59.82 40.54,59.82 J18.3 40.21,59.82 37.93,59.82 J18.2 37.6,59.82 35.32,59.82 J18.1
N$18
  Top 0.5: J19.7 50.33,57.2 48.04,57.2 J19.6 47.72,57.2 45.43,57.2 J19.5 45.11,57.2 43.15,57.2 J19.4 42.82,57.2 40.54,57.2 J19.3 40.21,57.2 37.93,57.2 J19.2 37.6,57.2 35.32,57.2 J19.1
N$19  (7 unrouted)
N$20  (7 unrouted)
N$21  (7 unrouted)
N$24
  Top 0.406: R7.1 10.74,35.68 U2.5
N$52
  Top 0.5: J31.1 30.1,67.64 27.82,67.64 J31.2 27.49,67.64 25.21,67.64 J31.3 24.88,67.64 22.6,67.64 J31.4 22.27,67.64 19.99,67.64 J31.5 19.66,67.64 17.7,67.64 J31.6 17.38,67.64 15.1,67.64 J31.7
N$54
  Top 0.5: J32.1 30.1,69.93 27.82,69.93 J32.2 27.49,69.93 25.21,69.93 J32.3 24.88,69.93 22.6,69.93 J32.4 22.27,69.93 19.99,69.93 J32.5 19.66,69.93 17.7,69.93 J32.6 17.38,69.93 15.1,69.93 J32.7
N$55
  Top 0.406: R6.2 16.17,35.68 16.8,36.32 16.8,36.95 15.53,38.22 10.8,38.22 U2.1
N$56
  Top 0.5: J33.1 30.1,72.54 27.82,72.54 J33.2 27.49,72.54 25.21,72.54 J33.3 24.88,72.54 22.6,72.54 J33.4 22.27,72.54 19.99,72.54 J33.5 19.66,72.54 17.7,72.54 J33.6 17.38,72.54 15.1,72.54 J33.7
N$58
  Top 0.5: J34.1 30.1,75.15 27.82,75.15 J34.2 27.49,75.15 25.21,75.15 J34.3 24.88,75.15 22.6,75.15 J34.4 22.27,75.15 19.99,75.15 J34.5 19.66,75.15 17.7,75.15 J34.6 17.38,75.15 15.1,75.15 J34.7
N$59
  Top 1.016: R6.1 LED4.A
N$71
  Top 0.5: J25.1 50.33,65.03 48.04,65.03 J25.2 47.72,65.03 45.43,65.03 J25.3 45.11,65.03 43.15,65.03 J25.4 42.82,65.03 40.54,65.03 J25.5 40.21,65.03 37.93,65.03 J25.6 37.6,65.03 35.32,65.03 J25.7
N$72
  Top 0.5: J26.1 50.33,67.64 48.04,67.64 J26.2 47.72,67.64 45.43,67.64 J26.3 45.11,67.64 43.15,67.64 J26.4 42.82,67.64 40.54,67.64 J26.5 40.21,67.64 37.93,67.64 J26.6 37.6,67.64 35.32,67.64 J26.7
N$73
  Top 0.5: J27.1 50.33,69.93 48.04,69.93 J27.2 47.72,69.93 45.43,69.93 J27.3 45.11,69.93 43.15,69.93 J27.4 42.82,69.93 40.54,69.93 J27.5 40.21,69.93 37.93,69.93 J27.6 37.6,69.93 35.32,69.93 J27.7
N$74
  Top 0.5: J28.1 50.33,72.54 48.04,72.54 J28.2 47.72,72.54 45.43,72.54 J28.3 45.11,72.54 43.15,72.54 J28.4 42.82,72.54 40.54,72.54 J28.5 40.21,72.54 37.93,72.54 J28.6 37.6,72.54 35.32,72.54 J28.7
N$75
  Top 0.5: J29.1 50.33,75.15 48.04,75.15 J29.2 47.72,75.15 45.43,75.15 J29.3 45.11,75.15 43.15,75.15 J29.4 42.82,75.15 40.54,75.15 J29.5 40.21,75.15 37.93,75.15 J29.6 37.6,75.15 35.32,75.15 J29.7
N$76
  Top 0.5: J30.1 30.1,65.03 27.82,65.03 J30.2 27.49,65.03 25.21,65.03 J30.3 24.88,65.03 22.6,65.03 J30.4 22.27,65.03 19.99,65.03 J30.5 19.66,65.03 17.7,65.03 J30.6 17.38,65.03 15.1,65.03 J30.7
RESET
  Top 0.406: X1.1 45.44,21.02 J7.1 49.19,19.17 55.54,25.52 DEEPSLEEP.3 | RESET.B' RESET.B 62.82,38.54 63.48,38.54 63.79,38.22 63.79,32.51 62.52,31.23 R1.2
  Bottom 0.406: DEEPSLEEP.3 56.25,27.74 58.18,29.67 59.69,29.67 R1.2
RESET_KEY
  Top 0.406: Q2.3 27.85,107.18 28.87,106.16 28.87,101.08 29.51,100.45 32.86,100.45 U3.12
  Top 0.5: U3.12 32.71,100.3
RX
  Top 0.406: 28.32,22.98 X1.15 28.95,22.98 27.6,22.98 J3.1 25.06,21.08 23.79,19.8 23.79,14.72 27.6,10.91 27.6,10.28 29.51,8.38 36.11,8.38 DATAEXCHANGE.4
SIM_CLK  (via drill 0.6)
  Top 0.406: 39.98,96.73 U3.15 39.98,96.73 | v38.4,101.72 39.98,100.13 39.98,96.73
  Bottom 0.406: SIMCARD.C2 19.98,98.86 30.46,98.86 31.09,98.23 34.9,98.23 v38.4,101.72
SIM_DATA  (via drill 0.6)
  Top 0.406: v42.84,108.7 U3.17
  Bottom 0.406: SIMCARD.C7 30.87,121.31 42.84,109.34 v42.84,108.7
SIM_RST  (via drill 0.6)
  Top 0.406: 38.71,96.74 U3.14 38.4,96.91 38.4,98.54 37.76,99.18 37.12,99.18 v34.59,96.64
  Bottom 0.406: SIMCARD.C3 34.04,96.09 v34.59,96.64
TX
  Top 0.406: DATAEXCHANGE.5 38.33,12.19 27.92,12.19 25.7,14.72 J2.1 26.19,18.85 X1.16
UART_RX  (via drill 0.6)
  Top 0.406: v36.49,27.43 36.49,27.02 X1.13 28.76,26.79 26.96,26.79 26.33,26.16 J45.1 | v53.63,73.14 54.59,74.73 54.59,111.24 54.27,111.56 U3.30
  Bottom 0.406: v53.63,73.14 52.12,71.32 52.12,55.44 36.49,40.13 v36.49,27.43
UART_TX  (via drill 0.6)
  Top 0.406: v38.4,24.89 38.26,25.02 X1.14 28.86,24.89 27.6,24.89 26.33,23.62 J44.1 | v55.54,71.88 55.54,111.88 54.59,112.83 52.88,112.83 U3.31
  Bottom 0.406: v38.4,24.89 38.4,39.49 53,54.09 53,69.33 v55.54,71.88
V_BATT
  Top 0.813: U2.3 11.09,40.44 11.09,40.76
  Top 1.27: 11.09,40.76 11.04,40.76 D1.A C4.1 16.65,45.84 CN2.2
VCC  (1 unrouted)
  Top 0.813: 7.28,44.57 7.28,44.92 U1.3 | U1.1 6.32,47.43 | 28.23,6.47 28.23,5.31 28.68,4.87
  Top 1.27: U2.4 7.88,43.3 D1.C 5.38,41.34 5.38,27.43 18.52,14.29 J1.1 | 4.74,45.84 C5.1 | 4.74,45.84 6.01,44.57 7.28,44.57 | 6.32,47.43 4.74,45.84 | J1.1 19.1,11.48 23.47,7.11 27.6,7.11 28.23,6.47 | J1.1 19.1,16.39 5V.1
  Top 1.422: D1.C 7.33,44.52 7.28,44.57
  Bottom 0.5: 3.06,45.79 3.03,45.82 C5.1
  Bottom 1.422: LED4.K 25.06,39.49 23.79,38.22 13.63,38.22 10.46,35.05 7.28,35.05 2.83,39.49 C5.1
VSIM  (via drill 0.6)
  Top 0.406: 41.25,96.86 U3.16 41.44,101.85 39.66,103.62 v38.4,103.62
  Bottom 0.406: SIMCARD.C1 17.44,99.18 18.08,99.81 30.77,99.81 31.41,99.18 34.59,99.18 v38.4,103.62

### Text on the board
tPlace: xns ip67-ESP12-A7 rev A | xnsense.com | GND | 3.3V | 3.3V | GND | AI THINKER | GND | 3.3v | 15 | 13 | 2 | 12 | 0 | 14 | 4 | 16 | 5 | CHP | RX | ADC | TX | RST | 5V | GND | RX | TX